# EAGLE design amiga2gameport_alternate2 (EAGLE 4.16)
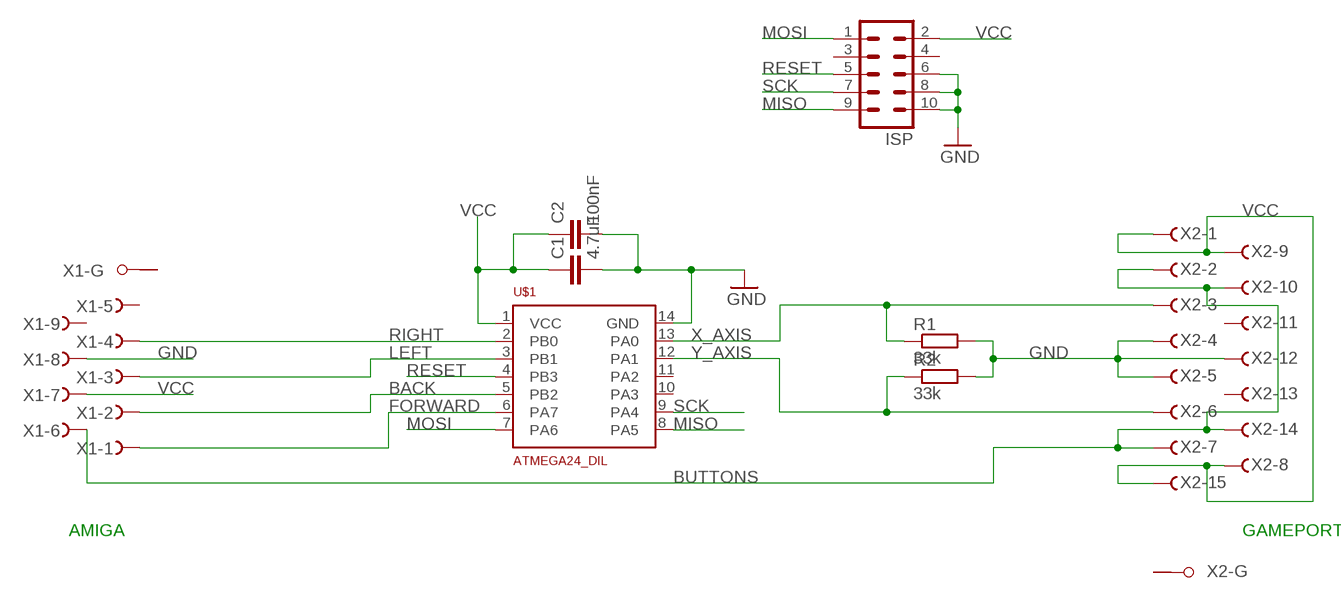
[diagram p0: schematic, sheet 1]

## Parts
C1  4.7uF  C-EU050-024X044  [C050-024X044]
C2  100nF  C-EU050-024X044  [C050-024X044]
ISP  MA05-2  [MA05-2]
R1  33k  R-EU_0309/10  [0309/10]
R2  33k  R-EU_0309/10  [0309/10]
U$1  ATMEGA24_DIL  [DIL14]
X1  F09HPS  [F09HP]
X2  F15HPS  [F15HP]

## Nets
BACK: U$1.5(PB2) X1.2(-2:F)
BUTTONS: X1.6(-6:F) X2.2(-2:F) X2.7(-7:F) X2.10(-10:F) X2.14(-14:F)
FORWARD: U$1.6(PA7) X1.1(-1:F)
GND: C1.2 C2.2 ISP.6 ISP.8 ISP.10 R1.2 R2.2 U$1.14(GND) X1.8(-8:F) X2.4(-4:F) X2.5(-5:F) X2.12(-12:F)
LEFT: U$1.3(PB1) X1.3(-3:F)
MISO: ISP.9 U$1.8(PA5)
MOSI: ISP.1 U$1.7(PA6)
RESET: ISP.5 U$1.4(PB3)
RIGHT: U$1.2(PB0) X1.4(-4:F)
SCK: ISP.7 U$1.9(PA4)
VCC: C1.1 C2.1 ISP.2 U$1.1(VCC) X1.7(-7:F) X2.1(-1:F) X2.8(-8:F) X2.9(-9:F) X2.15(-15:F)
X_AXIS: R1.1 U$1.13(PA0) X2.3(-3:F)
Y_AXIS: R2.1 U$1.12(PA1) X2.6(-6:F)
Unconnected: ISP.3 ISP.4 U$1.10(PA3) U$1.11(PA2) X1.5(-5:F) X1.9(-9:F) X1.G1(-G:G1) X1.G2(-G:G2) X2.11(-11:F) X2.13(-13:F) X2.G1(-G:G1) X2.G2(-G:G2)

## Notes on the sheet
- AMIGA | GAMEPORT

## Library data of the parts
C1 C2 = rcl:C-EU: CAPACITOR, European symbol
ISP = con-lstb:MA05-2: PIN HEADER
R1 R2 = rcl:R-EU_: RESISTOR, European symbol
U$1 = atmel:ATMEGA24_DIL
X1 = con-subd:F09HPS: SUB-D
X2 = con-subd:F15HPS: SUB-D

## Board
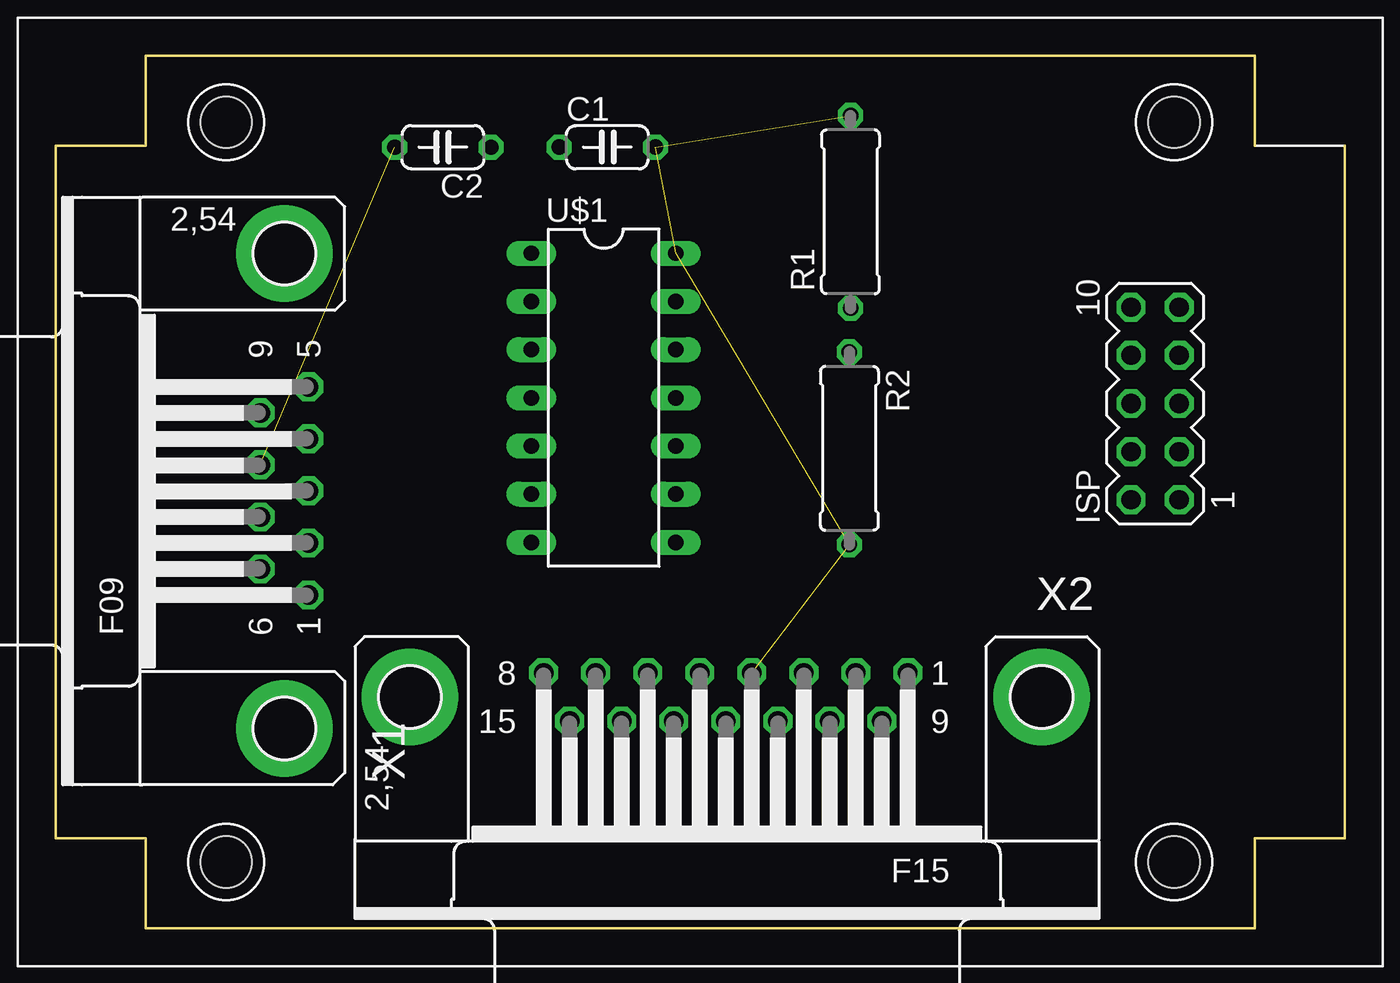
[diagram p1: board, top side]
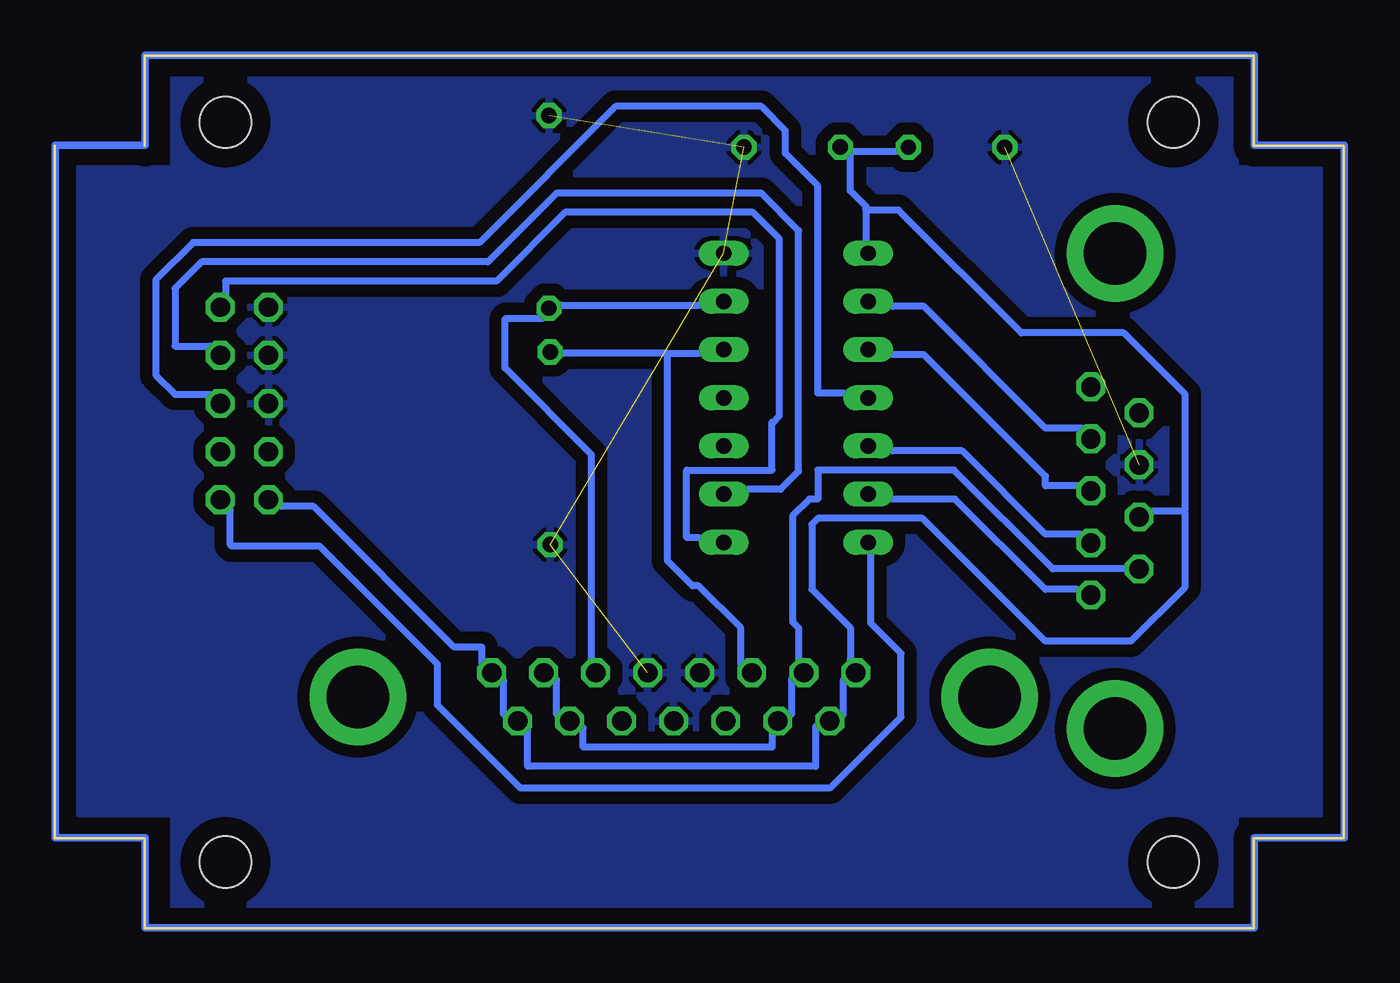
[diagram p2: board, bottom side, seen from below]

Size 68 x 46 mm. Coordinates in mm from the lower left corner, seen from the top.
Copper layers (1*16): Top 0.035mm / dielectric 1.5mm / Bottom 0.035mm
Design rules "default": minimum track width 15mil, minimum drill 24mil, track to track 25mil, track to pad 15mil, pad to pad 15mil, via to via 10mil, smd to smd 8mil, copper to edge 40mil, drill to drill 8mil, minimum pad ring 10mil, minimum via ring 8mil, stop-mask expansion 4mil, vias tented up to drill 0mil, thermal gap 10mil

### Footprints (pad centres in the part's own frame; a part is rotated, then mirrored left to right if it is on the bottom)
C050-024X044 = drill 0.813 octagon: 1 -2.54,0; 2 2.54,0
MA05-2 = drill 1.016 octagon: 1 -5.08,-1.27; 2 -5.08,1.27; 3 -2.54,-1.27; 4 -2.54,1.27; 5 0,-1.27; 6 0,1.27; 7 2.54,-1.27; 8 2.54,1.27; 9 5.08,-1.27; 10 5.08,1.27
0309/10 = drill 0.813 octagon: 1 -5.08,0; 2 5.08,0
DIL14 = drill 0.813 long: 1 -7.62,-3.81; 2 -5.08,-3.81; 3 -2.54,-3.81; 4 0,-3.81; 5 2.54,-3.81; 6 5.08,-3.81; 7 7.62,-3.81; 8 7.62,3.81; 9 5.08,3.81; 10 2.54,3.81; 11 0,3.81; 12 -2.54,3.81; 13 -5.08,3.81; 14 -7.62,3.81
G028 = hole 2.7: 9,-3.5; 59,-3.5; 9,-42.5; 59,-42.5
F09HP = drill 1.016 octagon: 1 -5.486,-1.27; 2 -2.743,-1.27; 3 0,-1.27; 4 2.743,-1.27; 5 5.486,-1.27; 6 -4.115,1.27; 7 -1.372,1.27; 8 1.372,1.27; 9 4.115,1.27 | drill 3.302 pad 5.08 round: G1 -12.522,0; G2 12.522,0
F15HP = drill 1.016 octagon: 1 -9.601,-1.27; 2 -6.858,-1.27; 3 -4.115,-1.27; 4 -1.372,-1.27; 5 1.372,-1.27; 6 4.115,-1.27; 7 6.858,-1.27; 8 9.601,-1.27; 9 -8.23,1.27; 10 -5.486,1.27; 11 -2.743,1.27; 12 0,1.27; 13 2.743,1.27; 14 5.486,1.27; 15 8.23,1.27 | drill 3.302 pad 5.08 round: G1 -16.662,0; G2 16.662,0

### Placement (x,y rotation side)
C1  29.11,41.19 0 top
C2  20.43,41.18 180 top
ISP  58,27.67 90 top
R1  41.93,37.78 90 top
R2  41.87,25.31 270 top
U$1  28.91,27.97 270 top
U$2  [G028]  0,46 0 top
X1  12.08,23.06 90 top
X2  35.35,12.2 180 top

### Tracks (layer width: path | path; a pad name or v marks a point on that pad's centre or on a via)
BACK
  Bottom 0.381: U$1.5 23.81,25.17 20.13,25.17 15.75,20.79 13.91,20.79 X1.2
BUTTONS
  Bottom 0.381: X2.2 41.53,13.11 41.53,11.27 X2.10 40.13,10.57 40.13,9.55 30.16,9.55 30.16,10.19 X2.14 29.15,11.27 29.15,13.11 X2.7 28.77,14.19 28.77,15.84 29.08,16.15 29.08,21.74 28.19,22.63 27.75,22.63 27.75,24.16 20.57,24.16 15.37,18.95 11.56,18.95 X1.6
FORWARD
  Bottom 0.381: U$1.6 23.81,22.63 20.51,22.63 15.75,17.87 14.1,17.87 X1.1
GND  (5 unrouted)
  pour Bottom: 5.73,45.04 61.73,45.04 61.73,40.04 66.73,40.04 66.73,6.04 61.73,6.04 61.73,1.04 5.73,1.04 5.73,6.04 0.73,6.04 0.73,40.04 5.73,40.04
LEFT
  Bottom 0.381: U$1.3 23.81,30.25 22.16,30.25 15.75,23.84 15.75,23.33 14.1,23.33 X1.3
MISO
  Bottom 0.381: U$1.8 34.04,20.6 34.67,20.6 34.67,24.16 30.16,24.16 30.16,26.7 30.1,26.7 29.78,27.01 29.78,36.35 31.18,37.74 41.08,37.74 44.7,34.13 58.99,34.13 58.99,33.49 ISP.9
MOSI
  Bottom 0.381: U$1.7 24.96,19.71 24.96,16.09 23.37,14.5 23.37,11.14 27.11,7.39 43.43,7.39 47.82,11.77 47.82,13.93 54.04,20.16 58.67,20.16 58.74,20.22 58.74,22.06 ISP.1
N$2
  Bottom 0.406: 4.73,46.04 63.23,46.04 63.23,41.29 67.98,41.29 67.98,4.79 63.23,4.79 63.23,0.04 4.73,0.04 4.73,4.79 -0.02,4.79 -0.02,41.29 4.73,41.29 4.73,46.04
RESET
  Bottom 0.381: U$1.4 26.42,28.22 27.75,28.22 27.75,39.14 29.46,40.86 29.46,42.06 30.73,43.33 38.42,43.33 45.59,36.16 60.71,36.16 62.67,34.19 62.67,29.17 61.66,28.16 59.82,28.16 ISP.5
RIGHT
  Bottom 0.381: U$1.2 23.81,32.79 22.16,32.79 15.75,26.38 13.84,26.38 X1.4
SCK
  Bottom 0.381: U$1.9 31.43,23.14 29.72,23.14 28.77,24.09 28.77,36.79 30.73,38.76 41.53,38.76 45.15,35.14 60.26,35.14 61.66,33.74 61.66,30.7 59.82,30.7 ISP.7
VCC
  Bottom 0.381: 25.21,37.87 25.21,38.06 26.04,38.89 26.04,40.79 C1.1 25.91,40.98 23.62,40.98 C2.1 | 25.21,37.87 25.21,36.22 U$1.1 | 8.45,22 10.1,22 X1.7 | 8.45,22 8.38,22.06 8.38,28.16 11.62,31.39 17.02,31.39 23.5,37.87 25.21,37.87 | ISP.2 56.01,22.25 54.36,22.25 46.93,14.82 45.47,14.82 45.47,14 X2.1 44.32,13.04 44.32,11.27 X2.9 43.05,10.44 43.05,8.54 27.88,8.54 27.88,10.63 X2.15 26.42,11.27 26.42,13.11 X2.8 26.04,14.19 26.04,15.84 28.07,17.87 28.07,21.3 27.75,21.62 22.23,21.62 15.75,15.14 11.24,15.14 8.38,18 8.38,21.87 8.45,22
X_AXIS
  Bottom 0.381: U$1.13 34.04,32.86 41.27,32.86 R1.1 42.29,32.16 44.2,32.16 44.26,32.09 44.26,29.55 39.69,24.98 39.69,14.19 X2.3
Y_AXIS
  Bottom 0.381: 35.69,30.32 41.21,30.32 R2.1 | 35.69,30.32 34.04,30.32 U$1.12 | X2.6 31.81,13.93 31.81,15.84 34.04,18.06 34.35,18.06 35.69,19.39 35.69,30.32